# EAGLE design EAGLE (EAGLE 9.6.2)
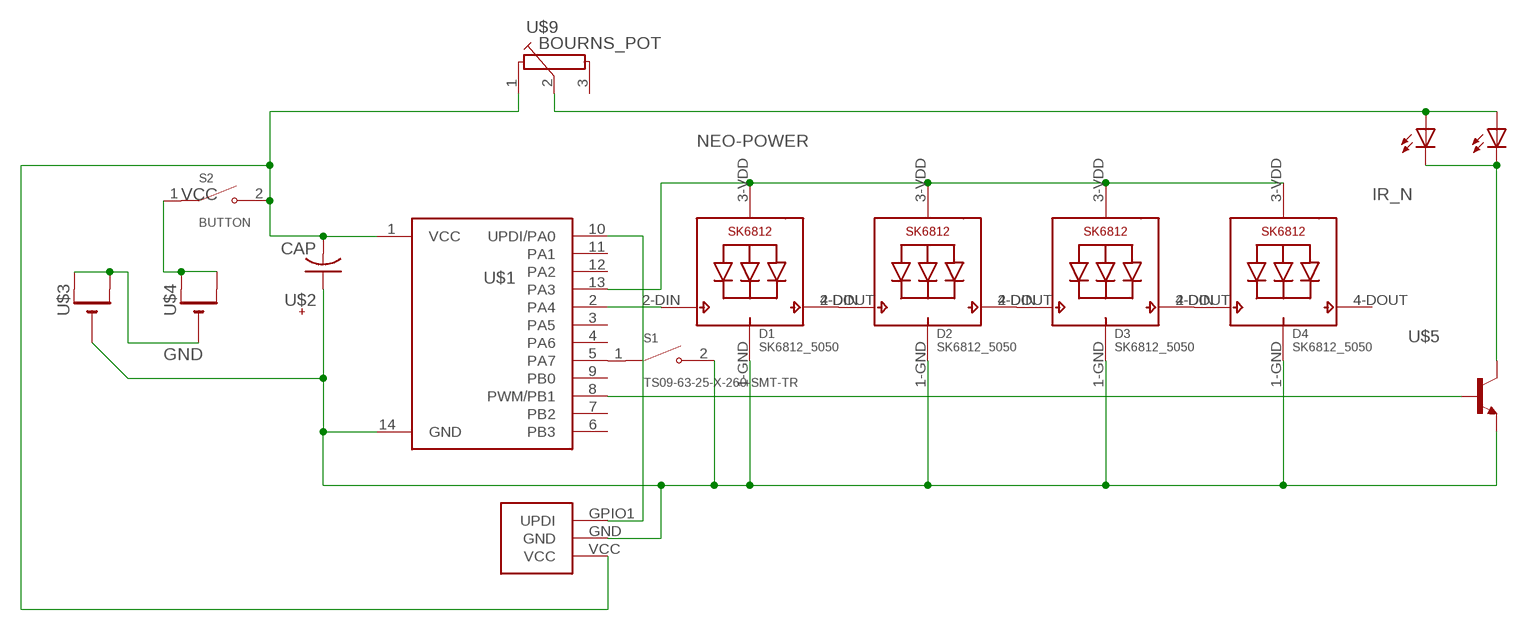
[diagram p0: schematic, sheet 1]

## Parts
D1  SK6812_5050  [SK6812_REVERSE_W_CUT]
D2  SK6812_5050  [SK6812_REVERSE_W_CUT]
D3  SK6812_5050  [SK6812_REVERSE_W_CUT]
D4  SK6812_5050  [SK6812_REVERSE_W_CUT]
S1  TS09-63-25-X-260-SMT-TR  [SW_TS09-63-25-X-260-SMT-TR]
S2  BUTTON  [SW_TS09-63-25-X-260-SMT-TR]
U$1  ATTINY1614ATTINY1614  [SO14]
U$2  CAP  [UD-6,3X5,8_NICHICON]
U$3  CR2032SMT  [CR2032-SMD]
U$4  CR2032SMT  [CR2032-SMD]
U$5  NPN  [SOT23]
U$6  LEDSIDESOLDER  [LED3MM_5MM_SIDESOLDER]
U$7  LEDSIDESOLDER  [LED3MM_5MM_SIDESOLDER]
U$8  SAO  [SAO_SMD]
U$9  BOURNS_POT  [3223W]

## Nets
GND: D1.1-GND(GND) D2.1-GND(GND) D3.1-GND(GND) D4.1-GND(GND) S1.2 U$1.14(GND) U$2.+ U$3.GND U$5.2(E) U$8.GND
IR_N: U$5.3(C) U$6.KN(C) U$7.KN(C)
IR_PWR: U$6.AN(A) U$7.AN(A) U$9.2(1S)
N$1: S1.1 U$1.5(PA7)
N$3: D1.4-DOUT(DO) D2.2-DIN(DI)
N$5: D2.4-DOUT(DO) D3.2-DIN(DI)
N$6: D3.4-DOUT(DO) D4.2-DIN(DI)
N$84: S2.1 U$4.+$1(+) U$4.+$2(+1)
N$85: U$3.+$1(+) U$3.+$2(+1) U$4.GND
NEO-POWER: D1.3-VDD(VDD) D2.3-VDD(VDD) D3.3-VDD(VDD) D4.3-VDD(VDD) U$1.13(PA3)
NEO_SIGNAL: D1.2-DIN(DI) U$1.2(PA4)
PWM: U$1.8(PWM/PB1) U$5.1(B)
UPDI: U$1.10(UPDI/PA0) U$8.GPIO1(UPDI)
VCC: S2.2 U$1.1(VCC) U$2.- U$8.VCC U$9.1(1A)
Unconnected: D4.4-DOUT(DO) U$1.3(PA5) U$1.4(PA6) U$1.6(PB3) U$1.7(PB2) U$1.9(PB0) U$1.11(PA1) U$1.12(PA2) U$9.3(1E)

## Library data of the parts
D1-D4 = 2025:SK6812_5050
S1 = 2025:TS09-63-25-X-260-SMT-TR; MANUFACTURER: CUI Devices; MAXIMUM_PACKAGE_HEIGHT: 2.5 mm; PARTREV: 1.0; STANDARD: Manufacturer Recommendations
S2 = 2025:BUTTON; MANUFACTURER: CUI Devices; MAXIMUM_PACKAGE_HEIGHT: 2.5 mm; PARTREV: 1.0; STANDARD: Manufacturer Recommendations
U$1 = 2025:ATTINY1614
U$2 = 2025:CAP
U$3 U$4 = 2025:CR2032
U$5 = 2025:NPN
U$6 U$7 = 2025:LED
U$8 = 2025:SAO
U$9 = 2025:BOURNS_POT

## Board
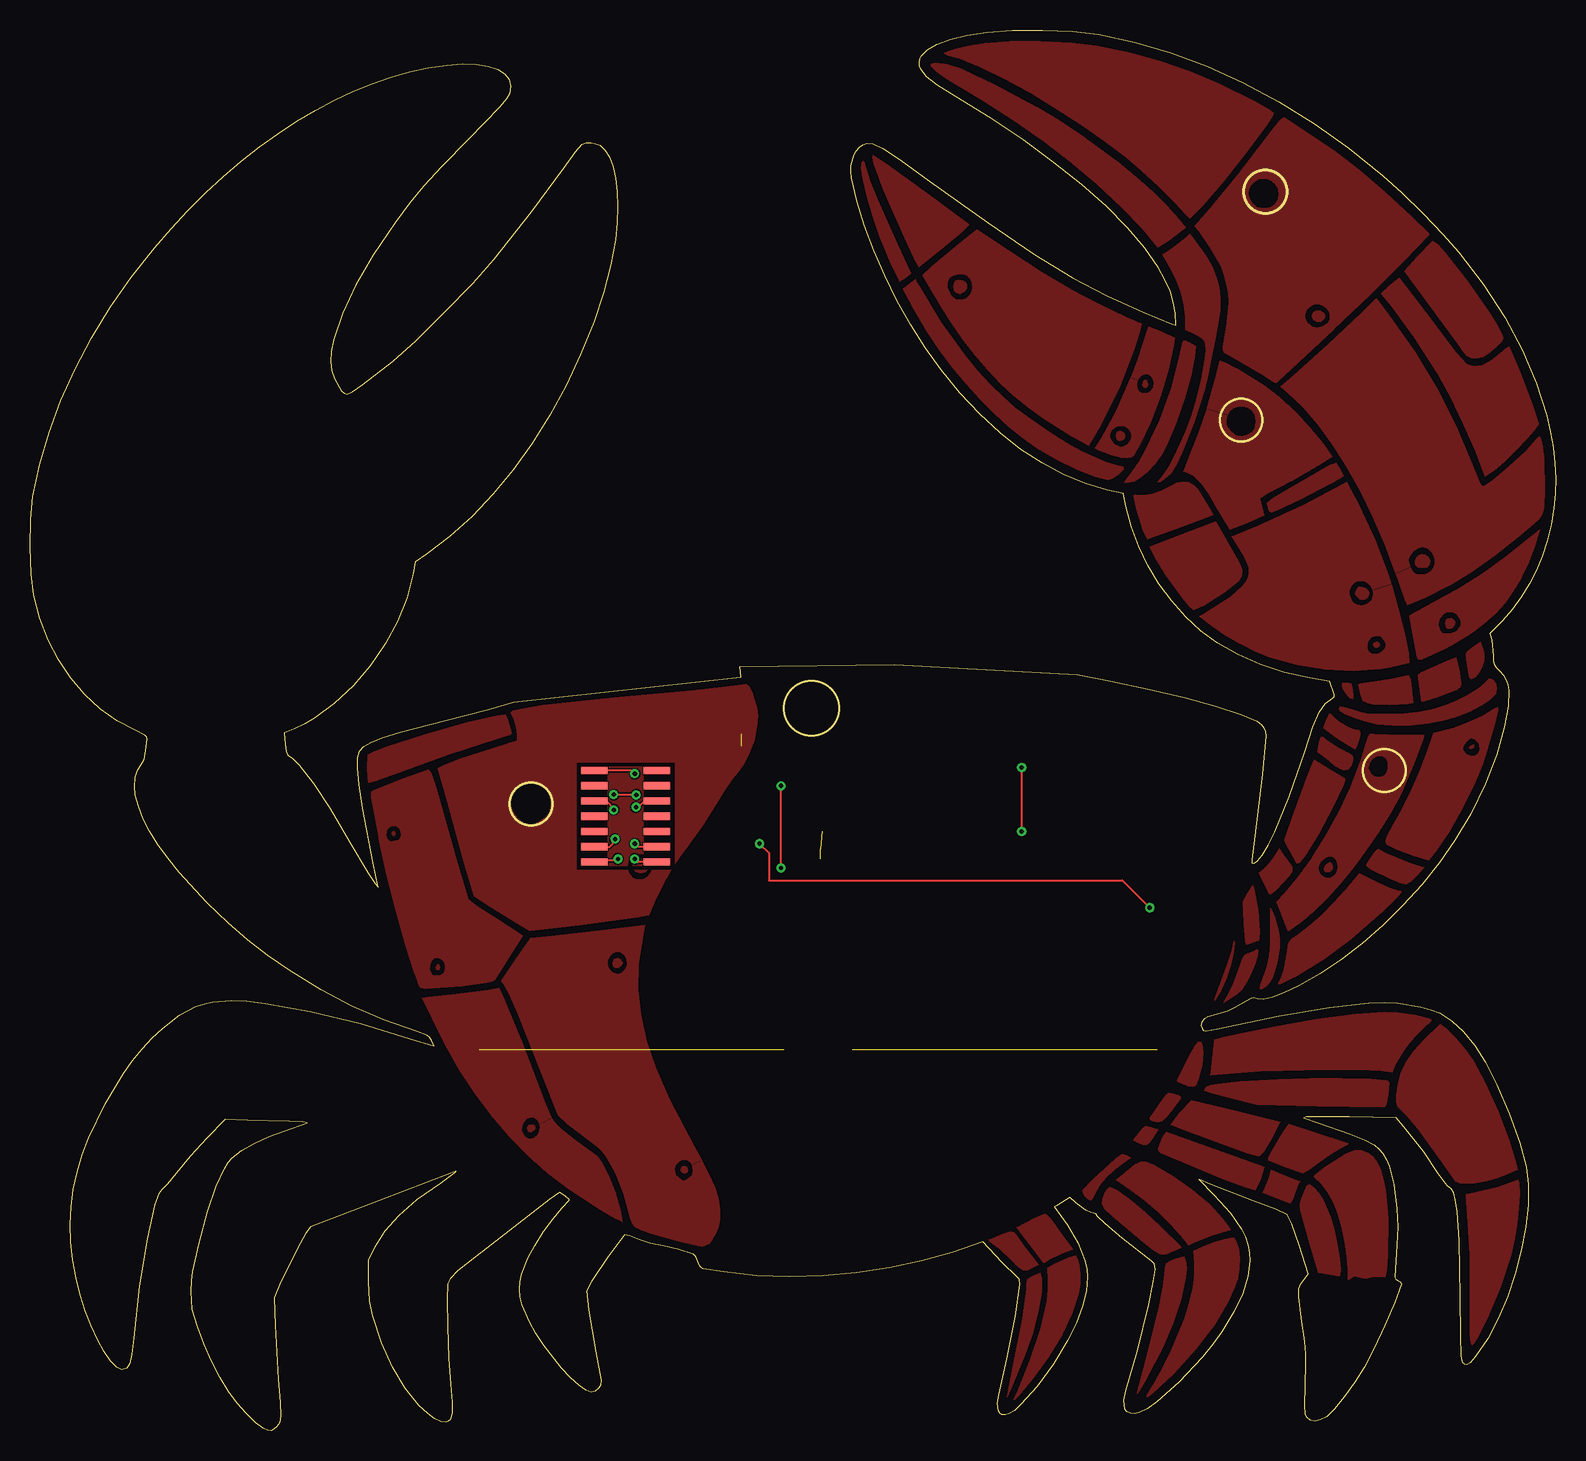
[diagram p1: board, top side]
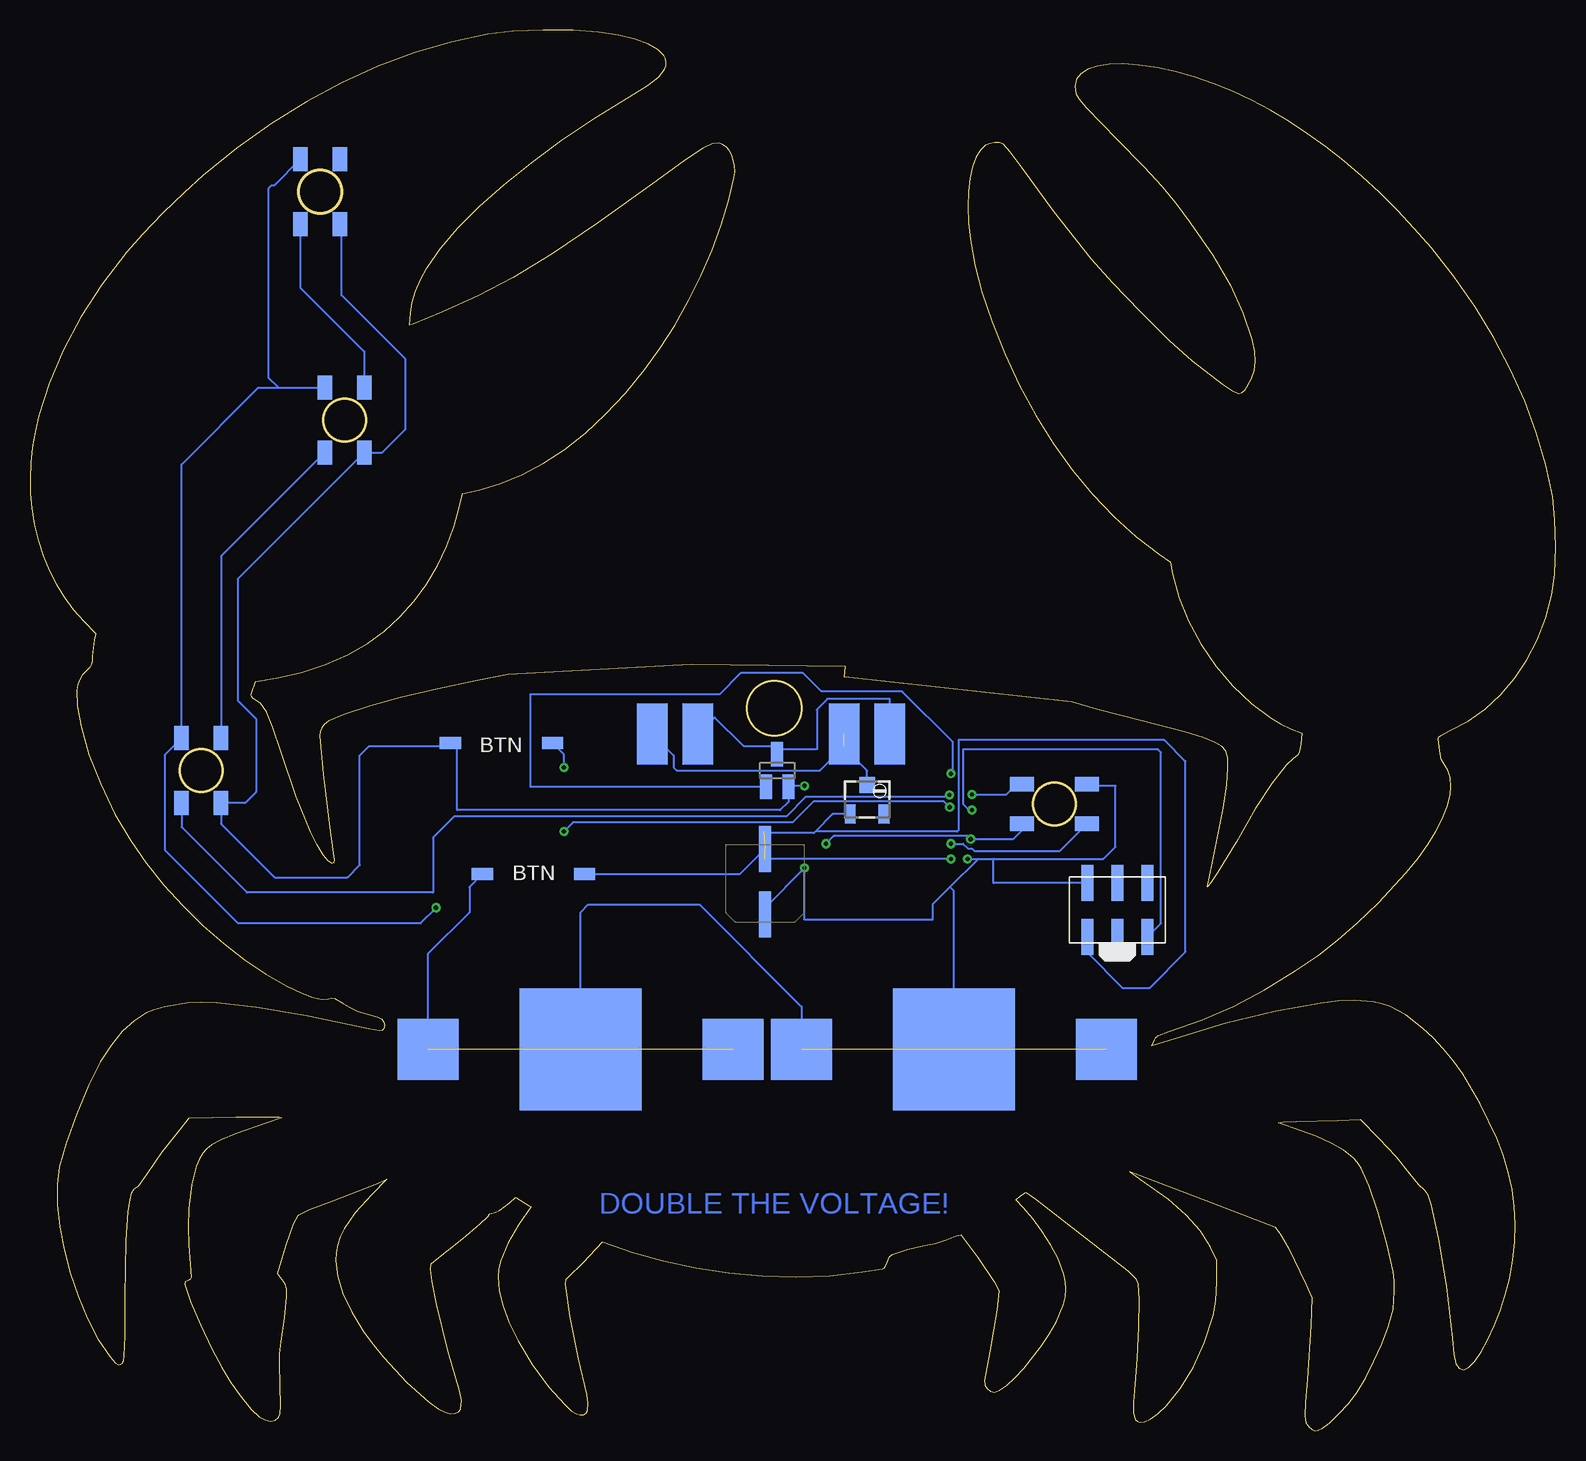
[diagram p2: board, bottom side, seen from below]

Size 127.18 x 116.75 mm. Coordinates in mm from the lower left corner, seen from the top.
Outline: 679 segments
Outline: circle at 112.89,55.01 radius 1.8
Outline: circle at 100.96,84.22 radius 1.8
Outline: circle at 102.99,103.27 radius 1.83
Outline: circle at 41.77,52.22 radius 1.8
Outline: circle at 65.14,60.22 radius 2.29
Copper layers (1*16): Top 0.035mm / dielectric 1.5mm / Bottom 0.035mm
Design rules "default *": minimum track width 6mil, minimum drill 0.35mm, track to track 4mil, track to pad 6mil, pad to pad 6mil, via to via 6mil, smd to smd 6mil, copper to edge 0mil, drill to drill 6mil, minimum pad ring 10mil, minimum via ring 8mil, stop-mask expansion 4mil, vias tented up to drill 100mil, thermal gap 10mil
tRestrict: area 46,54.1 to 48.1,54.6; area 46,52.9 to 48.1,53.4; area 46,51.6 to 48.1,52.1; area 46,50.3 to 48.1,50.8; area 46,47.8 to 48.1,48.3; area 51.2,47.8 to 53.3,48.3; area 51.2,49 to 53.3,49.6; area 51.2,50.3 to 53.3,50.8; area 51.2,51.6 to 53.3,52.1; area 51.2,52.9 to 53.3,53.4; area 51.2,54.1 to 53.3,54.6; area 46,46.8 to 53.3,47; 5 more areas

### Footprints (pad centres in the part's own frame; a part is rotated, then mirrored left to right if it is on the bottom)
SK6812_REVERSE_W_CUT = smd 2 x 1.2: 1-GND -2.7,-1.65; 2-DIN -2.7,1.65; 3-VDD 2.7,1.65; 4-DOUT 2.7,-1.65
SW_TS09-63-25-X-260-SMT-TR = smd 1.778 x 1: 1 -4.258,0; 2 4.258,0
SO14 = smd 0.6 x 2.2: 1 -3.81,-2.6; 2 -2.54,-2.6; 3 -1.27,-2.6; 4 0,-2.6; 5 1.27,-2.6; 6 2.54,-2.6; 7 3.81,-2.6; 8 3.81,2.6; 9 2.54,2.6; 10 1.27,2.6; 11 0,2.6; 12 -1.27,2.6; 13 -2.54,2.6; 14 -3.81,2.6
UD-6,3X5,8_NICHICON = smd 3.816 x 1: + 2.604,0; - -2.858,0
CR2032-SMD = smd 5.08 x 5.08: +$1 -12.7,0; +$2 12.7,0 | smd 10.16 x 10.16: GND 0,0
SOT23 = smd 1 x 2.035: 1 -0.95,-1.354; 2 0.95,-1.354; 3 0,1.354
LED3MM_5MM_SIDESOLDER = smd 2.54 x 5.08: AN -2.54,-5.08; KN 1.27,-5.08
SAO_SMD = smd 1 x 3: GND 5.5,1.5; GPIO1 0.5,6; GPIO2 0.5,1.5; SCL 3,1.5; SDA 3,6; VCC 5.5,6
3223W = smd 0.9 x 1.6: 1 -1.4,-1.215; 3 1.4,-1.215 | smd 1.3 x 1.3: 2 0,1.215

### Placement (x,y rotation side)
D1  41.77,52.22 180 bottom
D2  112.89,55.01 90 bottom
D3  100.96,84.22 90 bottom
D4  102.99,103.27 90 bottom
S1  87.88,57.3 180 bottom
S2  85.21,46.38 0 bottom
U$1  49.65,51.2 90 top
U$2  65.9,45.62 270 bottom
U$3  50.16,31.77 0 bottom
U$4  81.27,31.77 0 bottom
U$5  64.89,55.01 0 bottom
U$6  56.76,63.14 0 bottom
U$7  72.76,63.14 0 bottom
U$8  33.52,47.14 180 bottom
U$9  57.4,52.6 0 bottom

### Tracks (layer width: path | path; a pad name or v marks a point on that pad's centre or on a via)
GND  (via drill 0.35)
  Top 0.152: U$1.14 47.18,47.52 48.89,47.52 v49.01,47.65 | v62.6,46.89 v62.6,53.74
  Bottom 0.152: D4.1-GND 101.21,100.45 101.21,94.64 95.88,89.3 95.88,83.46 97.81,81.52 D3.1-GND 109.85,70.98 109.85,60.86 108.32,59.33 108.32,53.24 109.24,52.31 D2.1-GND 111.24,50.57 106.8,46.12 100.7,46.12 99.69,47.14 99.69,56.28 98.92,57.05 91.56,57.05 | S1.2 91.56,57.3 91.56,57.05 | D1.1-GND 38.95,53.74 36.69,53.74 36.69,48.66 37.71,47.65 46.85,47.65 | v49.01,47.65 48.12,47.65 | 48.12,47.65 46.85,47.65 | 91.56,57.05 91.56,51.71 64.63,51.71 63.94,52.41 U$5.2 63.85,53.74 v62.6,53.74 | 48.12,47.65 50.47,45.3 | 50.47,45.3 51.93,43.84 51.93,42.57 62.6,42.57 v62.6,46.89 65.9,43.58 U$2.+ | U$8.GND 46.85,45.64 46.85,47.65 | 54.67,31.77 U$3.GND 50.16,44.98 50.47,45.3
IR_N
  Bottom 0.152: U$6.KN 55.49,60.98 60.7,60.98 61.59,60.09 61.59,56.79 64.76,56.79 64.89,56.92 | 64.89,56.92 64.89,57.05 67.68,57.05 70.1,59.46 U$7.KN | 64.89,56.92 U$5.3
IR_PWR  (1 unrouted)
  Bottom 0.152: 59.36,56.98 61.33,55.01 73.27,55.01 73.52,55.27 73.52,56.28 U$7.AN 76.01,58.77 | 59.36,56.98 59.3,57.05 | U$9.2 57.4,55.01 59.36,56.98
N$1  (via drill 0.35)
  Top 0.152: U$1.5 51.23,52.47 50.72,51.97 v50.51,51.97 | v82.67,49.93 v82.67,55.27
  Bottom 0.152: v50.51,51.97 51.02,52.47 61.84,52.47 63.62,50.7 81.91,50.7 v82.67,49.93 | v82.67,55.27 82.67,56.35 S1.1
N$2
  pour Top: 34.81,52.46 34.03,55.22 34.51,55.5 35.79,56 39.69,57.24 39.84,57.28 41.06,53.93 40.65,53.65 40.31,53.29 40.07,52.88 39.99,52.44 40.09,51.91 40.34,51.38 40.71,50.93 41.13,50.64 41.72,50.52 42.13,50.61 42.6,50.84 43.02,51.15 43.29,51.48 43.45,51.92 43.47,52.37 43.39,52.81 43.21,53.23 42.95,53.59 42.62,53.88 42.23,54.07 41.8,54.14 41.45,54.09 41.11,53.96 39.89,57.3 40.66,57.52 40.66,58.08 40.58,58.65 40.39,59.23 40.12,59.85 40.33,60.01 40.87,60.17 42.77,60.49 48.67,61.12 55.13,61.71 57.71,61.97 59.41,62.21 59.65,62.22 59.9,62.05 60.14,61.59 60.56,60.28 60.63,59.66 60.61,58.98 60.34,57.53 59.78,56.1 59.41,55.45 58.99,54.86 58.54,54.3 57.8,53.26 57.01,52 56,50.42 54.59,48.44 54.1,47.79 53.56,46.99 53,46.03 51.89,46.78 51.89,47.29 51.79,47.54 51.62,47.77 51.32,47.98 50.95,48.08 50.57,48.08 50.21,47.96 50.02,47.81 49.88,47.6 49.77,47.08 49.86,46.54 50.17,46.11 50.47,45.99 50.89,45.94 51.25,46.01 51.54,46.17 51.75,46.42 51.88,46.72 52.98,45.99 52.08,44.13 51.56,42.92 50.65,42.76 45.78,42.12 41.68,41.66 40.66,42.27 38.49,43.61 37.05,44.51 36.25,47.29
N$3  (via drill 0.35)
  Top 0.152: v48.66,53.01 50.51,53.01 v50.54,52.98
  Bottom 0.152: D2.2-DIN 114.54,50.31 109.08,44.85 93.59,44.85 93.59,49.43 91.81,51.2 64.13,51.2 62.48,52.86 50.66,52.86 v50.54,52.98 | D1.4-DOUT 44.95,53.87 45.84,52.98 48.63,52.98 v48.66,53.01
N$4
  pour Top: 28.23,54 28.15,55.2 28.18,56.35 28.7,56.63 29.76,57.03 32.89,58.03 36.35,59.01 38.95,59.59 39.59,59.69 39.79,59.19 40.07,58.34 40.09,58.13 39.98,57.98 38.96,57.65 34.95,56.36 30.21,54.65 28.84,54.15
N$5
  Bottom 0.152: D3.2-DIN 111.24,72.89 D2.4-DOUT
N$6
  Bottom 0.152: D4.2-DIN 104.64,95.27 99.31,89.94 D3.4-DOUT
N$7
  pour Top: 28.45,53.21 28.44,52.77 29.04,49.51 29.69,49.64 29.73,49.96 29.87,50.22 30.09,50.4 30.37,50.45 30.58,50.38 30.78,50.23 30.9,50.03 30.94,49.58 30.74,49.2 30.02,49.07 29.98,49.11 29.77,49.32 29.7,49.59 29.05,49.46 29.12,49.1 29.74,46.28 30.52,43.23 31.33,40.38 32.04,38.2 33.32,38.47 33.38,39.01 33.51,39.23 33.69,39.4 33.99,39.46 34.22,39.36 34.42,39.18 34.56,38.93 34.61,38.64 34.57,38.3 34.45,38.06 34.23,37.92 33.91,37.88 33.58,37.96 33.38,38.22 33.33,38.42 32.05,38.15 32.41,37.17 32.56,36.94 32.94,36.85 35.99,37.09 38.05,37.34 38.56,37.47 38.76,37.62 39.94,39.47 41.06,41.24 38.9,42.65 37.32,43.66 36.56,44.25 35.55,47.56 33.88,53.49 33.46,54.72 33.23,55.08 30.98,54.26 28.62,53.33
N$8
  pour Top: 30.22,49.63 30.18,49.78 30.22,49.92 30.31,49.98 30.41,49.92 30.45,49.78 30.41,49.63 30.31,49.57
N$9
  pour Top: 33.9,38.79 33.83,38.63 33.86,38.48 34.01,38.42 34.16,38.48 34.18,38.65 34.11,38.81 34.01,38.86
N$10
  pour Top: 39.57,37.13 39.31,37.46 40.53,39.26 41.76,41.05 43.46,41.23 48.18,41.78 51.24,42.13 51.01,40.89 50.71,38.87 49.81,38.87 49.83,38.94 49.78,39.32 49.61,39.6 49.37,39.8 49.08,39.89 48.78,39.87 48.5,39.75 48.26,39.51 48.11,39.16 48.1,38.86 48.19,38.57 48.38,38.32 48.63,38.15 49.05,38.08 49.4,38.19 49.66,38.44 49.8,38.82 50.7,38.82 50.66,36.77 50.88,34.67 51.36,32.49 52.13,30.2 53.25,27.63 55.27,23.81 55.97,22.53 55.2,22.17 55.1,22.35 54.9,22.49 54.68,22.55 54.33,22.53 54.02,22.37 53.79,22.11 53.7,21.76 53.8,21.29 54.17,20.97 54.48,20.81 54.85,20.99 55.21,21.27 55.31,21.67 55.23,22.13 55.99,22.49 56.62,21.28 57.08,20.26 57.36,19.35 57.48,18.45 57.47,17.57 57.36,16.95 57.13,16.43 56.77,15.8 56.58,15.58 56.36,15.42 56.01,15.31 54.2,15.72 51.83,16.39 50.96,16.69 50.47,16.95 50.21,17.27 50.07,17.75 49.51,19.75 48.85,21.45 48.12,22.77 47.76,23.25 47.39,23.59 44.87,25.51 44.07,26.26 42.68,29.71 40.72,34.69 40,36.32
N$11
  pour Top: 48.65,38.71 48.59,38.96 48.71,39.3 48.98,39.4 49.18,39.29 49.39,38.98 49.24,38.71 49.01,38.57 48.8,38.57
N$12
  pour Top: 33.55,34.35 32.75,36.07 33.24,36.16 35.55,36.4 38.22,36.72 39.06,36.9 39.31,36.41 41.02,32.26 42.93,27.22 43.44,26.07 42.5,25.56 42.42,25.79 42.27,25.96 42.07,26.05 41.8,26.09 41.53,26.04 41.3,25.93 41,25.54 40.95,25.04 41.03,24.8 41.2,24.57 41.42,24.41 41.64,24.33 42.08,24.39 42.41,24.71 42.54,25.24 42.51,25.51 43.47,26.02 43.77,25.59 44.17,25.18 45.39,24.24 47.23,22.9 47.71,22.25 48.24,21.17 48.76,19.82 49.2,18.35 49.37,17.38 48.85,17.64 47.66,18.35 44.84,20.21 43.14,21.5 41.52,22.94 39.98,24.52 38.51,26.23 37.14,28.07 35.85,30.04 34.65,32.14
N$13
  pour Top: 54.3,21.95 54.24,21.75 54.3,21.59 54.45,21.49 54.64,21.48 54.81,21.56 54.86,21.7 54.8,21.85 54.67,21.97 54.49,22.02
N$14
  pour Top: 41.52,25.04 41.49,25.22 41.53,25.37 41.64,25.48 41.8,25.52 41.98,25.47 42.07,25.36 42.09,25.21 42,25.04 41.72,24.85 41.6,24.9
N$15
  pour Top: 50.27,46.89 50.27,47.16 50.4,47.42 50.62,47.61 50.89,47.69 51.13,47.6 51.35,47.36 51.49,47.08 51.5,46.83 51.25,46.54 50.88,46.46 50.51,46.57
N$16
  pour Top: 80.02,15.75 79.94,15.89 81.1,16.4 81.72,16.59 81.97,16.54 82.18,16.32 82.82,15.39 84.07,13.83 83.65,13.6 83.17,13.36 82.83,13.34 82.45,13.6 81.84,14.2 80.84,15.15 80.27,15.59
N$17
  pour Top: 84.52,13.98 82.29,16.95 83.71,17.68 84.58,18.05 84.6,18.06 84.77,17.95 85.07,17.66 85.99,16.35 86.71,15.39 86.89,15.15 86.86,15.07 85.96,14.75 84.87,14.21
N$18
  pour Top: 82.34,3.36 82,2.59 82.1,2.6 82.4,2.9 83.61,4.35 84.95,6.18 86.07,8.04 86.91,9.83 87.44,11.48 87.54,12.21 87.56,13.02 87.5,13.76 87.36,14.26 87.2,14.56 86.6,14.39 85.4,13.86 84.8,13.51 84.86,12.62 84.86,11.76 84.75,10.79 84.24,8.45 83.37,5.86
N$19
  pour Top: 81.96,5.38 81.42,2.83 81.59,3.08 81.98,3.93 82.96,6.26 83.59,8.13 84.07,9.96 84.35,11.55 84.37,12.68 84.24,13.13 83.67,12.91 83.35,12.75 83.16,12.55 83.08,12.26 83.06,11.79 82.72,9.3
N$20
  pour Top: 87.81,19.81 87.77,20.03 88.65,20.95 90.55,22.68 91.03,23.02 91.2,23.02 91.4,22.93 91.75,22.75 91.01,22.24 90.29,21.68 89.65,21.05 89.12,20.4 88.78,19.8 88.56,19.38 88.4,19.2 88.2,19.3 87.98,19.54
N$21
  pour Top: 89.4,19.26 89.34,18.89 89.58,18.53 90.24,17.88 92.86,15.68 93.71,15.02 94.24,14.73 94.72,14.75 95.38,15.02 95.97,15.27 94.22,17 92.96,18.18 91.69,19.23 90.64,19.98 90.02,20.27 89.82,20.11 89.58,19.71
N$22
  pour Top: 91.8,20.04 90.55,20.89 91.38,21.57 92.14,22.18 92.63,22.44 93.06,22.41 93.65,22.14 95.26,21.21 96.87,20.07 98.29,18.86 99.37,17.7 100.01,16.81 100.02,16.67 99.87,16.64 98.61,16.29 97.09,15.69 96.6,15.44 96.03,16.19 95.2,17.12 94.12,18.17 92.94,19.19
N$23
  pour Top: 92.37,23.98 92,24.18 92.27,24.55 92.8,25.23 92.97,25.35 93.14,25.36 93.48,25.26 94.01,25.1 93.6,24.44 93.31,24.02 93.05,23.82 92.76,23.81
N$24
  pour Top: 93.44,25.89 93.37,26.02 93.73,26.57 94.48,27.64 94.71,27.99 94.92,28.13 95.22,28.1 95.73,27.92 95.89,27.83 95.88,27.67 95.2,26.74 94.67,26.1 94.31,25.78 94,25.69 93.65,25.79
N$25
  pour Top: 95.79,29.01 95.66,29.14 96.67,31.27 97.13,32.07 97.4,32.41 97.56,32.38 97.68,32.2 97.77,31.49 97.68,30.49 97.41,29.38 97.17,28.83 97.05,28.7 96.91,28.65 96.57,28.7 96.15,28.84
N$26
  pour Top: 99.35,29.7 98.42,29.59 98.51,30.28 98.68,31.79 98.76,32.63 99.72,32.84 103.62,33.67 107.3,34.3 110.51,34.72 112.99,34.89 113.98,34.86 115.48,34.64 116.59,34.37 116.75,34.28 116.75,34.16 116.08,33.49 115.39,32.8 114.74,32.01 114.18,31.21 113.78,30.46 113.52,29.87 112.61,29.97 110.83,30.05 108.07,30.07 102.58,29.94 102.58,29.94
N$27
  pour Top: 98.52,28.11 97.92,28.32 97.97,28.52 98.14,28.68 98.47,28.81 99.01,28.92 100.87,29.11 104.03,29.29 106.59,29.36 109.41,29.37 111.79,29.32 113.04,29.21 113.19,29.14 113.26,28.99 113.18,28.04 113.02,27.14 112.92,26.98 112.77,26.94 107.28,27.01 102.29,27.16 99.97,27.74
N$28
  pour Top: 94.32,24.24 94.02,23.44 94.11,23.28 94.32,23.15 95.59,22.61 99.49,20.99 101.3,20.31 102.14,20.05 102.33,20.34 102.6,20.99 102.88,21.93 94.72,24.84 94.56,24.66
N$29
  pour Top: 96.14,25.05 95.1,25.5 95.92,26.52 96.85,27.5 100.53,26.67 104.2,25.73 103.45,24.29 102.79,23.23 102.57,22.97 102.41,22.87 101.5,23.13 99.67,23.77
N$30
  pour Top: 103.23,22.76 103.22,22.58 104.63,21.99 106.12,21.49 106.55,21.72 107.3,22.27 108.23,22.95 109.09,23.48 109.91,23.9 109.54,24.04 104.95,25.52 104.67,25.21 104.22,24.47 103.39,23.05
N$31
  pour Top: 103.82,19.39 102.79,19.82 103,20.21 103.35,21.17 103.5,21.73 104.67,21.25 105.83,20.77 105.65,20.42 105.32,19.5 105.16,19.1 105,18.95
N$32
  pour Top: 105.92,18.34 105.9,18.85 106.03,19.34 106.44,20.34 106.56,20.49 106.66,20.52 107.03,20.23 107.4,19.8 107.77,19.22 108.41,17.76 108.68,16.79 108.94,15.53 109.13,14.3 109.21,13.39 109.2,13 109.09,12.87 108.13,13.03 107.44,13.13 106.72,15.52
N$33
  pour Top: 107.18,21.02 107.05,21.12 107.09,21.26 107.95,21.95 109.76,23.1 110.48,23.4 111.04,23.34 111.51,23.14 111.92,22.81 112.26,22.35 112.55,21.73 112.78,20.97 112.96,20.04 113.17,17.65 113.15,14.59 113.05,13.36 112.92,12.78 112.02,12.83 111.73,12.73 111.35,12.63 110.37,12.84 109.88,12.58 109.88,13.45 109.82,14.47 109.65,15.66 109.38,16.9 109.06,18.06 108.67,19.01 108.18,19.89 107.66,20.6
N$34
  pour Top: 93.56,3.69 93.08,2.85 93.22,2.86 93.64,3.18 95.33,4.78 97.21,6.82 98.76,8.87 99.94,10.85 100.37,11.79 100.68,12.67 100.82,13.49 100.85,14.38 100.76,15.19 100.56,15.75 100.35,16.08 99.5,15.89 98.66,15.64 97.83,15.31 97,14.92 97.07,13.93 97.07,12.99 96.93,11.91 96.64,10.7 96.21,9.32 95.7,8.02 95,6.46 94.24,4.92
N$35
  pour Top: 93.02,5.93 92.28,3.11 92.34,3.15 92.5,3.39 93.06,4.33 94.42,6.9 95.31,8.97 95.98,11 96.36,12.75 96.42,13.45 96.39,14 96.21,14.49 95.42,14.26 94.97,14.08 94.71,13.86 94.59,13.53 94.56,13.02 94.43,11.99 94.08,10.27
N$36
  pour Top: 114.02,27.04 113.92,27.41 113.94,27.99 114.06,28.86 114.3,29.79 114.73,30.69 115.36,31.6 116.25,32.61 117.58,33.85 118.03,33.52 118.81,32.72 119.65,31.74 120.29,30.85 121.28,29 122.34,26.61 123.27,24.19 123.85,22.24 123.97,21.72 123.14,21.35 122.27,21.02 121.35,20.76 120.45,20.6 119.71,20.55 119.18,20.61 118.86,20.78 117.7,22.45 115.71,25.16 114.81,26.25 114.23,26.81
N$37
  pour Top: 119.89,17.32 119.73,19.68 120.65,19.88 122.26,20.29 123.89,20.87 124.02,20.89 124.11,20.62 124.13,19.75 124.08,18.53 123.95,17.27 123.73,15.97 123.42,14.65 122.58,11.96 121.43,9.32 120.58,7.61 120.33,7.23 120.24,7.16 120.17,7.19 120.08,7.52 120.05,8.23 120.08,10.93 120.07,14.65
N$38
  pour Top: 99.33,37.53 98.73,35.94 98.76,35.87 98.86,35.96 99.33,36.74 99.73,37.65 100.11,38.79 100.37,39.88 100.44,40.64 100.41,40.78 100.33,40.64 100.17,40.04 99.82,38.89
N$39
  pour Top: 100.08,36.02 99.53,35.71 99.94,36.42 100.36,37.29 100.77,38.38 101.16,39.44 101.33,39.66 101.53,39.77 102.14,40.04 102.28,40.11 102.35,40.02 102.3,39.61 102.12,38.94 101.78,38.12 101.37,37.32 100.98,36.74 100.58,36.36
N$40
  pour Top: 101.23,42.26 101.14,44.1 101.54,44.78 101.93,45.46 102.08,44.9 102.35,43.33 102.48,41.62 102.43,40.96 102.32,40.82 102.12,40.73 101.54,40.51 101.42,40.52 101.34,40.75
N$41
  pour Top: 102.55,37.14 102.52,36.84 102.69,36.83 103.06,37.07 103.34,37.38 103.6,37.82 104,38.98 104.19,40.32 104.19,40.98 104.12,41.59 103.76,42.83 103.55,43.33 103.39,43.53 103.41,41.9 103.41,40.65 103.31,39.6 103.1,38.66 102.76,37.71
N$42
  pour Top: 102.92,46.88 102.42,46.45 102.88,45.53 103.18,44.93 103.3,44.79 103.43,44.75 103.81,45.01 104.49,45.72 104.99,46.27 105.23,46.65 105.25,46.93 105.08,47.19 104.46,47.99 104.13,48.5 103.78,47.9 103.38,47.35
N$43
  pour Top: 104.29,43.27 103.93,44.06 104.65,44.83 105.81,46.23 106.92,47.78 107.56,47.38 107.4,47.13 107.35,46.89 107.39,46.64 107.54,46.38 107.79,46.17 108.14,46.08 108.51,46.13 108.83,46.3 109,46.57 109.07,46.93 109.03,47.3 108.9,47.62 108.64,47.81 108.3,47.86 107.95,47.75 107.64,47.5 107.58,47.43 106.95,47.83 108.12,49.68 109.19,51.65 110.14,53.7 110.94,55.81 111.66,55.68 111.52,55.23 111.71,54.77 111.97,54.56 112.32,54.48 112.68,54.52 113,54.7 113.17,54.96 113.24,55.32 113.21,55.69 113.07,56.01 112.81,56.21 112.48,56.25 112.12,56.14 111.81,55.89 111.69,55.72 110.96,55.86 111.37,57.13 111.62,57.89 111.72,58.05 111.82,58.11 112.02,58.08 114.28,57.98 116.19,57.97 116.11,57.64 115.33,55.53 114.21,53 113.4,51.49 112.46,49.95 111.42,48.42 110.31,46.94 109.17,45.55 108.03,44.28 106.92,43.18 105.86,42.3 104.9,41.64 104.72,42.06
N$44
  pour Top: 107.95,47.01 107.87,46.83 107.9,46.68 108.03,46.58 108.37,46.59 108.6,46.85 108.61,47.05 108.52,47.24 108.35,47.36 108.11,47.2
N$45
  pour Top: 104.75,48.82 104.61,49.23 105.42,51.59 106.61,54.78 107.07,55.89 108.27,55.15 109.52,54.41 109.59,54.28 109.47,53.86 108.62,52.01 107.41,49.74 106.23,47.86 105.77,47.33 105.63,47.29 105.58,47.41 105.09,48.24
N$46
  pour Top: 108.09,56.01 107.35,56.55 107.47,57.32 107.65,57.81 107.75,57.8 107.92,57.67 108.83,57.05 109.91,56.46 110.16,56.31 110.26,56.12 110.24,55.83 110.09,55.42 109.86,55.11 109.57,55.03 109.24,55.14 108.87,55.37
N$47
  pour Top: 108.24,58.25 107.87,58.58 108.09,59.26 108.36,59.79 108.7,59.45 109.04,59.15 109.55,58.82 110.07,58.55 110.45,58.44 110.72,58.4 110.85,58.25 110.86,57.97 110.75,57.53 110.57,57.04 110.44,56.83 109.08,57.66
N$48
  pour Top: 113.13,49.61 112.98,49.11 113.05,48.94 113.23,48.8 113.91,48.47 115.36,47.93 116.6,47.57 117.24,48.36 118.38,50.09 119.43,51.91 120.35,53.75 121.1,55.54 121.48,56.74 120.87,56.82 120.81,56.61 120.69,56.42 120.48,56.24 120.25,56.17 120,56.22 119.72,56.37 119.51,56.59 119.44,56.84 119.52,57.13 119.75,57.46 120.09,57.76 120.46,57.63 120.78,57.3 120.87,56.87 121.49,56.79 122.1,58.84 122.38,60.11 122.34,60.29 122.08,60.14 121.14,59.58 119.92,59.02 118.64,58.53 117.5,58.21 116.98,58.11 116.48,56.63 115.9,55.09 115.21,53.49 114.44,51.93 113.66,50.52
N$49
  pour Top: 111.85,46.74 111.45,47.05 111.46,47.19 111.57,47.4 112.08,48.13 112.38,48.5 113.11,48.11 115.01,47.32 116.18,46.93 115.57,46.23 115.05,45.72 114.68,45.54 114.19,45.67 113.41,45.98
N$50
  pour Top: 104.12,37.25 104.1,37.34 104.22,37.53 104.37,37.83 104.56,38.44 104.85,39.99 104.91,40.47 105.02,40.77 105.23,41 105.63,41.28 106.59,42.01 107.67,42.95 108.75,44.02 109.72,45.1 110.85,46.43 112.27,45.72 113.36,45.21 114,45 114.22,44.97 114.32,44.88 113.86,44.35 112.74,43.27 110.08,40.92 107.8,39.25 105.43,37.83 104.19,37.21
N$51
  pour Top: 98.54,67.07 97.5,67.88 98.66,68.57 100.16,69.54 101.11,70.38 101.41,70.77 101.58,71.16 101.66,71.54 101.63,71.92 101.26,72.81 100.43,74.18 100.2,74.53 102.39,75.45 106.13,77.15 108.8,78.58 109.75,79.08 110.73,77.21 112.1,74.25 113.24,71.27 113.45,70.57 111.96,70.12 111.8,70.4 111.58,70.62 111.29,70.76 110.97,70.81 110.61,70.77 110.32,70.63 110.11,70.39 109.96,70.04 109.95,69.74 110.06,69.39 110.24,69.07 110.45,68.88 111.02,68.79 111.52,68.92 111.89,69.25 112.03,69.72 111.96,70.07 113.47,70.52 114.04,68.51 114.55,66.42 114.89,64.75 114.94,64 113.34,63.6 112.6,63.48 112.4,64.79 112.76,64.97 113,65.24 113.07,65.57 112.92,65.91 112.64,66.18 112.19,66.21 111.76,66.11 111.52,65.8 111.42,65.47 111.44,65.17 111.57,64.93 111.81,64.77 112.07,64.73 112.35,64.78 112.55,63.47 110.34,63.31 108,63.42 105.64,63.81 103.36,64.46 102.15,64.96 100.83,65.62 99.57,66.35
N$52
  pour Top: 104.88,86.48 104.25,87.01 105.35,87.95 108.28,90.56 111.1,93.21 112.25,94.34 113.33,92.89 115.43,89.89 117.27,86.85 118.84,83.75 120.17,80.58 120.79,79.04 120.98,78.77 121.13,78.72 121.45,78.88 121.97,79.24 123.32,80.35 124.71,81.64 125.65,82.69 125.81,82.86 125.91,82.74 126.08,82.03 126.2,80.97 126.24,78.37 126.19,77.07 126.11,76.65 125.96,76.29 125.71,75.95 125.32,75.57 123.98,74.45 122,72.89 120.14,71.58 118.29,70.46 116.36,69.46 114.87,68.79 114.64,69.26 114.26,70.37 113.89,71.43 115.05,71.92 115.23,71.61 115.42,71.44 115.78,71.36 116.18,71.37 116.54,71.47 116.83,71.64 117.04,71.92 117.14,72.23 117.15,72.56 117.07,72.88 116.91,73.18 116.68,73.41 116.4,73.57 116.06,73.63 115.66,73.53 115.27,73.26 114.97,72.92 114.85,72.56 115.03,71.97 113.87,71.48 112.98,73.85 112,76.13 110.93,78.31 109.79,80.34 108.6,82.2 107.38,83.86 106.13,85.3
N$53
  pour Top: 116.94,68.98 114.99,67.89 115.6,64.52 115.71,64.31 116.01,64.32 117.93,65.19 118.93,65.74 118.73,66.52 118.38,66.4 118.04,66.38 117.74,66.46 117.55,66.64 117.4,67.2 117.52,67.72 117.85,68.11 118.08,68.22 118.34,68.26 118.64,68.21 118.88,68.09 119.07,67.9 119.2,67.68 119.26,67.42 119.25,67.16 119.16,66.9 118.98,66.67 118.77,66.54 118.98,65.76 120.15,66.48 121.19,67.27 122.13,68.11 122.96,69.04 123.7,70.05 124.35,71.15 124.92,72.36 125.42,73.69 125.84,75.06 124.87,74.28 123.03,72.8 121.16,71.45 119.15,70.2
N$54
  pour Top: 116.02,60.83 115.73,62.99 116.01,63.23 116.67,63.54 118.2,64.2 118.85,64.44 119.1,63.44 119.29,62.25 119.2,61.99 118.89,61.75 117.29,61.12 116.19,60.76 116.07,60.76
N$55
  pour Top: 119.75,64.31 119.71,64.63 119.76,64.85 119.93,65.04 120.28,65.29 120.9,65.72 121.04,65.37 121.17,64.8 121.17,64.22 121.03,63.66 120.77,63.17 120.43,62.77 120.19,62.63 120.02,62.77 119.92,63.18
N$56
  pour Top: 109.23,59.97 109.16,60.13 109.19,60.29 109.29,60.35 109.49,60.34 110.29,60.09 110.88,59.89 111.42,59.78 113.11,59.73 114.51,59.77 115.73,59.89 116.83,60.11 117.88,60.43 118.95,60.86 119.96,61.36 120.78,61.86 121.31,62.3 121.7,62.68 121.83,62.66 121.99,62.54 122.18,62.25 122.25,61.86 122.13,61.41 121.68,60.93 120.96,60.42 120.06,59.95 119.01,59.53 117.86,59.18 116.55,58.94 115.05,58.79 113.57,58.76 112.32,58.86 111.47,59.06 110.51,59.37 109.68,59.7
N$57
  pour Top: 110.98,61.32 110.75,62.1 110.76,62.21 110.9,62.28 111.72,62.39 113.43,62.63 114.74,62.94 114.89,62.95 114.89,62.95 115.04,62.56 115.19,61.46 115.29,60.64 114.85,60.55 113.34,60.47 111.96,60.53 111.48,60.65 111.16,60.83
N$58
  pour Top: 109.48,61.8 109.4,62.13 109.42,62.3 109.72,62.34 109.95,62.33 110.09,62.25 110.22,61.75 110.28,61.24 110.24,60.99 110.09,61.01 109.84,61.26
N$59
  pour Top: 112.05,65.35 111.97,65.53 112.08,65.69 112.26,65.77 112.42,65.66 112.5,65.48 112.39,65.32 112.21,65.24
N$60
  pour Top: 110.68,69.47 110.5,69.74 110.55,70 110.71,70.23 110.87,70.34 111.06,70.34 111.3,70.21 111.52,70.03 111.61,69.83 111.58,69.63 111.42,69.41 111.23,69.26 111.07,69.21 110.9,69.28
N$61
  pour Top: 115.51,72.16 115.46,72.44 115.59,72.77 115.8,73 116.04,73.08 116.29,73.03 116.53,72.83 116.7,72.54 116.63,72.22 116.42,71.96 116.07,71.89 115.72,71.96
N$62
  pour Top: 118.03,67.51 117.97,67.33 118.02,67 118.23,66.85 118.5,66.91 118.75,67.18 118.81,67.4 118.69,67.58 118.46,67.69 118.14,67.63
N$63
  pour Top: 98.37,101.83 97.12,100.4 97.43,100.02 98.41,98.6 99.25,97.09 99.53,96.35 99.74,95.56 99.88,94.78 99.93,94.06 99.78,92.37 99.46,90.35 99.43,90.09 99.53,89.9 100.56,89.31 102.76,88.02 103.74,87.41 103.91,87.36 103.99,87.44 106.32,89.63 108.67,91.83 108.14,92.29 107.79,92.02 107.36,91.9 106.91,91.97 106.53,92.27 106.33,92.61 106.25,92.92 106.33,93.24 106.53,93.57 106.75,93.78 107.01,93.9 107.43,93.93 107.74,93.83 108.01,93.65 108.22,93.39 108.35,93.05 108.33,92.66 108.17,92.33 108.7,91.86 111.69,94.71 114.51,97.53 116.64,99.71 115.18,101.14 112.99,103.18 110.84,105.01 108.67,106.68 106.45,108.2 104.55,109.43 104.42,109.39 104.21,109.18 103.54,108.35 100.68,104.64 101.86,103.9 101.94,104.02 102.45,104.35 102.99,104.4 103.41,104.27 103.77,103.99 104.01,103.59 104.1,103.07 104.02,102.55 103.78,102.17 103.38,101.94 102.84,101.86 102.29,101.94 101.9,102.27 101.65,102.67 101.55,103.08 101.62,103.48 101.83,103.86 100.65,104.6
N$64
  pour Top: 107.04,92.57 106.89,92.83 106.93,93.13 107.06,93.28 107.22,93.36 107.5,93.37 107.85,93.15 107.93,92.97 107.9,92.75 107.59,92.45 107.3,92.41
N$65
  pour Top: 113.37,95.44 112.66,94.79 113.53,93.72 115.4,91.14 117.26,88.23 118.38,86.19 119.5,83.91 120.44,81.77 121.05,80.12 121.28,79.55 122.06,80.08 122.88,80.79 123.87,81.73 124.78,82.68 125.38,83.41 125.75,83.95 125.26,85.48 124.24,88.22 123.35,90.26 123.26,90.3 123.1,90.24 122.54,89.78 121.76,89.14 121.05,88.78 120.39,88.69 119.76,88.85 118.81,89.91 116.83,92.54 114.16,96.08
N$66
  pour Top: 116.57,93.98 114.59,96.65 115.69,97.87 116.94,99.14 117.29,98.9 117.95,98.19 119.78,95.86 121.62,93.22 122.31,92.12 122.7,91.35 122.75,91.06 122.63,90.77 122.29,90.4 121.66,89.88 121.04,89.47 120.51,89.36 120.15,89.4 119.83,89.58 119.48,89.97 119.01,90.64
N$67
  pour Top: 96.6,79.76 96.17,79.95 96.78,81.44 97.48,83.22 98.13,85.14 99.78,84.65 99.68,84.26 99.7,83.92 99.82,83.6 100.06,83.3 100.41,83.04 100.8,82.92 101.22,82.94 101.67,83.1 101.94,83.28 102.11,83.49 102.2,83.78 102.22,84.19 102.13,84.66 101.89,85.03 101.53,85.28 101.06,85.36 100.6,85.32 100.24,85.2 99.97,84.99 99.79,84.7 99.79,84.7 98.15,85.19 98.87,87.75 99.21,89.21 99.63,89.04 100.58,88.53 102.82,87.16 104.07,86.2 105.44,84.92 106.74,83.54 107.76,82.27 108.52,81.17 107.69,80.65 105.14,79.15 103.08,78.05 102.49,77.68 102.71,76.94 102.87,76.26 101.49,75.67 100.06,75.11 99.04,76.82 98.32,78.06 97.69,78.95 97.12,79.51
N$68
  pour Top: 103.29,76.81 103.16,77.32 103.66,77.73 104.87,78.46 107.66,80.06 108.45,80.51 108.84,80.66 109.21,80.08 109.48,79.56 108.44,78.94 105.92,77.6 103.93,76.67 103.47,76.54 103.37,76.61
N$69
  pour Top: 92.28,76.82 92.03,77.92 92.13,78.02 92.39,77.99 92.95,77.97 93.62,78.1 94.33,78.34 94.98,78.68 95.6,79 96.15,79.12 96.56,79.06 96.94,78.85 97.3,78.48 97.66,77.95 98.36,76.76 98.61,76.32 98.3,76.19 95.65,75.18 93.21,74.31 93.05,74.52 92.81,75.08
N$70
  pour Top: 93.8,72.77 93.35,73.67 93.91,73.89 96.61,74.92 98.8,75.78 99.25,75 100.33,73.15 100.79,72.34 101,71.71 100.97,71.21 100.7,70.79 99.52,69.87 97.77,68.75 97.03,68.4 96.7,68.68 96.09,69.39 94.71,71.26
N$71
  pour Top: 94.16,79.07 94.02,79.06 94.44,79.57 94.97,80.37 95.66,81.69 96.35,83.23 96.9,84.68 97.32,86.11 97.69,87.66 97.95,89.08 98.05,90.08 98.03,90.58 97.89,90.9 97.57,91.16 96.99,91.45 96.34,91.75 96.34,92.81 96.25,93.83 95.99,94.91 95.57,95.99 95.01,97.04 94.45,98.03 95.14,98.49 96.24,99.33 96.7,99.73 97.37,98.81 98.01,97.88 98.51,97.01 98.87,96.15 99.09,95.29 99.19,94.4 99.17,93.43 99.04,92.37 98.8,91.17 98.39,89.16 98.19,88.05 97.88,86.79 97.03,84.09 96.04,81.58 95.55,80.57 95.09,79.82 94.47,79.27
N$72
  pour Top: 91.59,79.01 91.21,79.01 91.95,79.98 92.51,80.8 93.08,81.82 94.21,84.26 95.18,86.9 95.83,89.36 96.1,90.63 96.2,90.84 96.35,90.85 96.66,90.67 97.14,90.39 97.06,89.54 96.77,87.98 96.23,86.05 95.53,84.01 94.75,82.15 94.31,81.38 93.76,80.62 93.14,79.94 92.49,79.39 92.01,79.12
N$73
  pour Top: 89.16,81.71 88.79,81.9 89.34,82.75 90.6,85.04 91.78,87.71 92.3,87.56 92.22,87.23 92.26,86.91 92.41,86.64 92.64,86.5 93.09,86.48 93.44,86.65 93.67,86.97 93.72,87.41 93.66,87.67 93.52,87.86 93.34,87.99 93.12,88.05 92.68,87.97 92.49,87.82 92.33,87.61 91.8,87.76 92.35,89.21 92.82,90.63 93.27,92.01 94.36,91.59 95.4,91.11 95.31,90.47 94.9,88.53 94.22,86.29 93.38,84.07 92.49,82.17 91.92,81.25 91.71,81.11 91.45,81.06 90.91,81.12 90.19,81.31 90.65,82.1 90.93,81.97 91.2,82.05 91.52,82.25 91.73,82.46 91.84,82.7 91.87,82.95 91.83,83.18 91.7,83.39 91.51,83.56 91.26,83.67 90.95,83.71 90.63,83.67 90.37,83.56 90.16,83.39 90.03,83.19 89.98,82.95 90.01,82.71 90.13,82.47 90.34,82.25 90.61,82.12 90.14,81.33
N$74
  pour Top: 75.17,95.03 74.42,96.33 75.25,97.05 77.5,98.93 78.92,100.09 81.63,98.3 84.33,96.57 86.75,95.14 89.05,93.92 91.39,92.83 92.65,92.25 92.49,91.61 92.01,90.17 90.86,87.12 89.27,83.89 88.24,82.11 86.88,82.85 84.54,84.36 83.27,85.27 82.08,86.24 80.94,87.29 79.85,88.42 78.8,89.65 77.78,90.98 76.77,92.43 75.78,94.01 76.7,94.68 76.89,94.48 77.13,94.33 77.13,94.33 77.44,94.26 77.76,94.28 78.14,94.43 78.41,94.68 78.57,94.99 78.62,95.34 78.57,95.69 78.4,96.01 78.13,96.26 77.75,96.42 77.39,96.42 77.39,96.42 76.84,96.22 76.62,96.06 76.5,95.87 76.43,95.57 76.44,95.28 76.67,94.73 75.75,94.05
N$75
  pour Top: 73.3,95.58 72.78,95.17 73.51,93.77 74.76,91.66 75.78,90.16 76.87,88.71 78.01,87.32 79.19,86.01 80.39,84.8 81.61,83.71 82.81,82.74 84,81.91 85.65,80.95 87.36,80.11 88.86,79.51 89.86,79.28 90.24,79.4 90.7,79.69 91.17,80.19 91.14,80.31 90.94,80.35 90.42,80.46 89.59,80.75 87.65,81.59 86.44,82.27 84.95,83.22 83.42,84.27 82.11,85.25 81.09,86.13 80.05,87.16 78.99,88.32 77.95,89.59 75.94,92.37 74.13,95.36 73.82,95.92
N$76
  pour Top: 70.26,106.26 70.23,106.14 70.33,105.65 71.15,103.4 72.89,99.43 73.69,97.72 74.08,97.02 76.22,98.71 77.68,99.94 78.27,100.51 75.34,102.69 71.44,105.53 70.33,106.29
N$77
  pour Top: 69.33,105.64 69.29,105.22 69.43,104.29 69.78,102.8 70.26,101.14 70.75,99.66 71.77,97.22 72.47,95.81 72.99,96.11 73.45,96.5 72.32,98.92 70.65,102.63 70.04,104.2 69.68,105.28 69.54,105.68 69.42,105.8
N$78
  pour Top: 75.19,113.68 75.12,113.84 75.14,113.94 75.48,114.01 76.5,113.88 77.65,113.54 80.45,112.19 83.94,110.31 85.69,109.26 87.43,108.12 90.7,105.71 92.2,104.49 93.55,103.27 94.74,102.09 95.73,100.97 96.3,100.29 96,100.01 94.91,99.19 94.03,98.63 93.8,98.88 92.75,100.21 91.06,101.96 88.97,103.9 86.7,105.82 84.51,107.48 82.06,109.18 79.59,110.79 77.3,112.15 76.34,112.73 75.62,113.26
N$79
  pour Top: 76.53,114.63 76.22,114.76 76.25,114.84 76.44,114.95 77.18,115.19 78.27,115.44 79.56,115.65 81.67,115.8 84.24,115.81 86.8,115.69 88.91,115.44 91.56,114.89 94.15,114.18 96.67,113.31 99.13,112.29 102.09,110.82 103.19,110.18 103.66,109.83 103.51,109.51 103.05,108.82 101.48,106.7 99.51,104.2 97.74,102.09 96.7,101.05 96.31,101.42 95.46,102.37 94.15,103.67 92.69,105.03 91.38,106.16 89.74,107.41 87.78,108.77 85.7,110.13 83.67,111.34 81.35,112.61 79.22,113.65 77.53,114.36
N$80
  pour Top: 90.57,83.12 90.53,82.93 90.62,82.59 90.8,82.51 91.02,82.54 91.21,82.67 91.31,82.86 91.29,83.02 91.19,83.16 90.88,83.3 90.66,83.24
N$81
  pour Top: 92.75,87.4 92.72,87.15 92.85,86.99 93.01,86.95 93.15,87.02 93.21,87.2 93.11,87.53 92.95,87.55
N$82
  pour Top: 77,95.59 76.96,95.32 77.02,95.06 77.19,94.88 77.53,94.76 77.89,94.98 78.11,95.23 78.1,95.52 78,95.69 77.83,95.83 77.4,95.91 77.15,95.81
N$83
  pour Top: 120.16,56.83 119.96,56.88 120.16,57.1 120.33,57.19 120.36,57.05 120.31,56.9
N$84  (1 unrouted)
  Bottom 0.152: S2.1 90.54,45.3 90.54,43.2 93.97,39.77 U$4.+$1
N$85  (1 unrouted)
  Bottom 0.152: U$4.GND 81.27,43.2 80.64,43.84 71.37,43.84 62.86,35.33 U$3.+$1
NEO-POWER  (via drill 0.35)
  Top 0.152: v48.76,49.3 48.76,49.11 48.32,48.66 U$1.13 | v60.82,48.92 61.59,48.16 61.59,45.87 91.05,45.87 v93.34,43.58
  Bottom 0.152: D4.3-VDD 106.83,103.78 107.05,103.78 107.31,103.53 107.31,87.78 106.45,86.92 D3.3-VDD 108.16,86.92 114.54,80.54 D2.3-VDD 115.94,56.32 115.94,48.41 109.85,42.31 94.61,42.31 v93.34,43.58 | D1.3-VDD 44.47,50.03 45.2,49.3 v48.76,49.3 49.01,49.55 60.19,49.55 v60.82,48.92
NEO_SIGNAL  (via drill 0.35)
  Top 0.152: U$1.2 50.66,48.66 v50.41,48.92
  Bottom 0.152: v50.41,48.92 49.39,48.92 48.99,48.51 48.64,48.51 48.46,48.33 41.31,48.33 D1.2-DIN
PWM  (via drill 0.35)
  Top 0.152: v50.41,54.76 50.16,55.01 U$1.8
  Bottom 0.152: U$5.1 85.46,53.66 85.46,61.36 69.71,61.36 67.94,63.14 62.73,63.14 61.21,61.62 54.47,61.62 50.28,57.43 50.28,54.89 v50.41,54.76
UPDI  (via drill 0.35)
  Top 0.152: v48.66,51.74 48.66,51.88 48.06,52.47 U$1.10
  Bottom 0.152: U$8.GPIO1 32.88,42.28 32.88,56.54 33.14,56.79 49.39,56.79 49.39,52.22 48.92,51.74 v48.66,51.74
VCC  (via drill 0.35)  (2 unrouted)
  Top 0.152: U$1.1 50.66,47.39 v50.41,47.65
  Bottom 0.152: v50.41,47.65 65.9,47.65 | 66.03,49.93 65.9,49.81 61.84,49.81 61.71,49.93 | U$9.1 60.26,51.39 61.71,49.93 | U$8.VCC 39.02,39.86 39.04,39.84 36.12,36.92 33.84,36.92 30.85,39.9 30.85,55.78 32.63,57.55 49.78,57.55 49.78,50.06 49.9,49.93 61.71,49.93 | S2.2 68,46.38 U$2.-

### Text on the board
Bottom: DOUBLE THE VOLTAGE!
bStop: DOUBLE THE VOLTAGE!
tDocu: .
bDocu: + | + | - | + | CTRL | POWER! | GND | RST | UPDI | 3V